# Altium schematic sheet swr-antenna.SchDoc
size A4; SheetNumber: 4; SheetTotal: 4
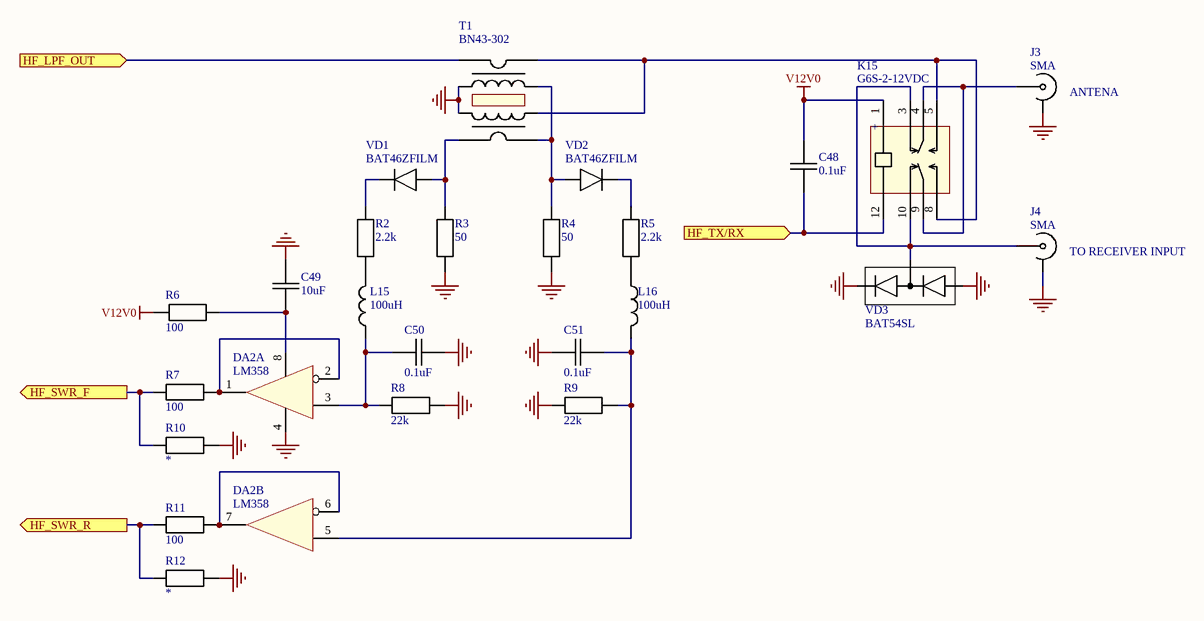
[diagram p0: swr-antenna.SchDoc]

## Parts
C48  0.1uF  [CAPC2013X100N]
C49  10uF  [CAPC2013X100N]
C50  0.1uF  [CAPC2013X100N]
C51  0.1uF  [CAPC2013X100N]
DA2  LM358  [SOIC127P600X175-8N]  (parts A,B of 2)
J3  SMA  [SMA002]
J4  SMA  [SMA002]
K15  G6S-2-12VDC  [G6S-2]
L15  100uH  [INDUCTOR-1008]
L16  100uH  [INDUCTOR-1008]
R2  2.2k  [RESC2013X64N]
R3  50  [RESC2013X64N]
R4  50  [RESC2013X64N]
R5  2.2k  [RESC2013X64N]
R6  100  [RESC2013X64N]
R7  100  [RESC2013X64N]
R8  22k  [RESC2013X64N]
R9  22k  [RESC2013X64N]
R10  *  [RESC2013X64N]
R11  100  [RESC2013X64N]
R12  *  [RESC2013X64N]
T1  BN43-302  [TANDEM]
VD1  BAT46ZFILM  [SOD3816X118N]
VD2  BAT46ZFILM  [SOD3816X118N]
VD3  BAT54SL  [SOT95P229X119-3N]

## Ports
HF_LPF_OUT (in), HF_SWR_F (out), HF_SWR_R (out), HF_TX/RX (in)

## Nets
GND: C49.1 C50.2 C51.1 DA2.4(GND) J3.2(GND) J4.2(GND) R3.1 R4.1 R8.1 R9.2 R10.1 R12.1 T1.3 T1.5 VD3.1(A) VD3.2(C)
V12V0: C48.2 K15.1 R6.1
HF_LPF_OUT: T1.1 ; port HF_LPF_OUT
HF_SWR_F: R7.2 R10.2 ; port HF_SWR_F
HF_SWR_R: R11.2 R12.2 ; port HF_SWR_R
HF_TX/RX: C48.1 K15.12 ; port HF_TX/RX
NetC49_2: C49.2 DA2.8(VCC) R6.2
NetC50_1: C50.1 DA2.3(IN1+) L15.1 R8.2
NetC51_2: C51.2 DA2.5(IN2+) L16.2 R9.1
NetDA2_1: DA2.1(OUT1) DA2.2(IN1-) R7.1
NetDA2_6: DA2.6(IN2-) DA2.7(OUT2) R11.1
NetJ3_1: J3.1(RF) K15.4 K15.9
NetJ4_1: J4.1(RF) K15.3 K15.10 VD3.3(AC)
NetK15_5: K15.5 K15.8 T1.2 T1.6
NetL15_2: L15.2 R2.1
NetL16_1: L16.1 R5.1
NetR2_2: R2.2 VD1.1(C)
NetR3_2: R3.2 T1.7 VD1.2(A)
NetR4_2: R4.2 T1.4 T1.8 VD2.2(A)
NetR5_2: R5.2 VD2.1(C)

## Notes on the sheet
- (near J3) ANTENA
- (near J4) TO RECEIVER INPUT
- (in symbol G6S-2-12VDC) +

## Library data of the parts
C48-C51 = Cap0805: Capacitor 2x1.25 mm
DA2 = LM358: Single Supply Dual / Operational Amplifiers
J3 = RF Connector: EM-BC028M-NGP-50
J4 = RF Connector
K15 = G6S-2-12VDC: Compact, Industry-Standard 2-pole relay
L15 L16 = Inductor: SWI1008HT101K-Hitano
R2-R12 = Res0805
T1 = tandem match
VD1 VD2 = DIODE: Small signal Schottky diodes; pin to pad: 1>2
VD3 = DIODE-2-1A-3C-3A-2C